# EAGLE schematic System_Schematic (EAGLE 8.7.1)
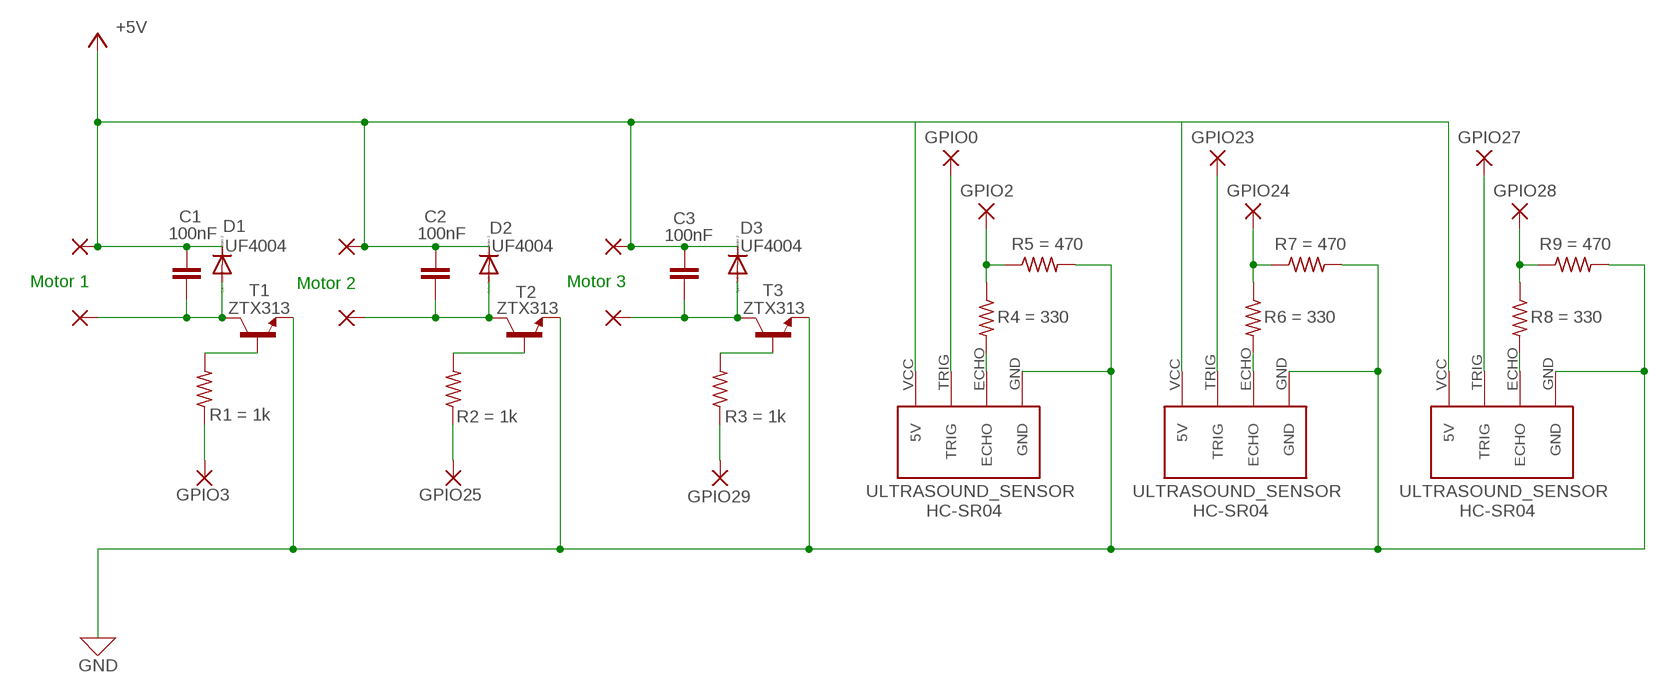
[diagram p0: schematic, sheet 1]

## Parts
C1  C15/6  [C15B6]
C2  C15/6  [C15B6]
C3  C15/6  [C15B6]
D1  BA243A  [DO35-10]
D2  BA243A  [DO35-10]
D3  BA243A  [DO35-10]
J_ULTRASONIC_1  HC-SR04  [HC-SR04_FOOTPRINT]
J_ULTRASONIC_2  HC-SR04  [HC-SR04_FOOTPRINT]
J_ULTRASONIC_3  HC-SR04  [HC-SR04_FOOTPRINT]
PAD1  3,81/1,4  [3,81/1,4]
PAD2  3,81/1,4  [3,81/1,4]
PAD3  3,81/1,4  [3,81/1,4]
PAD4  3,81/1,4  [3,81/1,4]
PAD5  3,81/1,4  [3,81/1,4]
PAD6  3,81/1,4  [3,81/1,4]
PAD7  3,81/1,4  [3,81/1,4]
PAD8  3,81/1,4  [3,81/1,4]
PAD9  3,81/1,4  [3,81/1,4]
PAD10  3,81/1,4  [3,81/1,4]
PAD11  3,81/1,4  [3,81/1,4]
PAD12  3,81/1,4  [3,81/1,4]
PAD13  3,81/1,4  [3,81/1,4]
PAD14  3,81/1,4  [3,81/1,4]
PAD15  3,81/1,4  [3,81/1,4]
R1  R-US_0207/15  [0207/15]
R2  R-US_0207/15  [0207/15]
R3  R-US_0207/15  [0207/15]
R4  R-US_0207/15  [0207/15]
R5  R-US_0207/15  [0207/15]
R6  R-US_0207/15  [0207/15]
R7  R-US_0207/15  [0207/15]
R8  R-US_0207/15  [0207/15]
R9  R-US_0207/15  [0207/15]
T1  2N706  [TO18]
T2  2N706  [TO18]
T3  2N706  [TO18]

## Nets
0: J_ULTRASONIC_1.GND J_ULTRASONIC_2.GND J_ULTRASONIC_3.GND R5.2 R7.2 R9.2 T1.1(E) T2.1(E) T3.1(E) ; supply symbol labelled GND
+5V: C1.1 C2.1 C3.1 D1.C D2.C D3.C J_ULTRASONIC_1.VCC(5V) PAD5.1(P) PAD6.1(P) PAD9.1(P)
+5V1: J_ULTRASONIC_2.VCC(5V)
+5V2: J_ULTRASONIC_3.VCC(5V)
N$1: PAD1.1(P) R1.1
N$2: PAD2.1(P) R2.1
N$3: PAD3.1(P) R3.1
N$4: R1.2 T1.2(B)
N$5: R2.2 T2.2(B)
N$6: R3.2 T3.2(B)
N$7: C1.2 D1.A PAD4.1(P) T1.3(C)
N$8: C2.2 D2.A PAD7.1(P) T2.3(C)
N$9: C3.2 D3.A PAD8.1(P) T3.3(C)
N$10: J_ULTRASONIC_2.TRIG PAD10.1(P)
N$11: J_ULTRASONIC_1.TRIG PAD11.1(P)
N$12: J_ULTRASONIC_2.ECHO R4.2
N$13: J_ULTRASONIC_1.ECHO R8.2
N$14: PAD15.1(P) R8.1 R9.1
N$15: PAD12.1(P) R4.1 R5.1
N$16: J_ULTRASONIC_3.TRIG PAD13.1(P)
N$17: J_ULTRASONIC_3.ECHO R6.2
N$18: PAD14.1(P) R6.1 R7.1

## Notes on the sheet
- Motor 1 | Motor 2 | Motor 3

## Library data of the parts
C1 = capacitor-wima:C: CAPACITOR naming: grid - package width; CAPPYU: 100nF
C2 C3 = capacitor-wima:C: CAPACITOR naming: grid - package width; CAPPY: 100nF
D1-D3 = diode:BA243A: DIODE
J_ULTRASONIC_1-J_ULTRASONIC_3 = Ultrasonic Sensor HC-SR04:HC-SR04: Ultrasonic Sensor HC-SR04
PAD1-PAD15 = wirepad:3,81/1,4: THROUGH-HOLE PAD
R1 = rcl:R-US_: RESISTOR, American symbol; R1: 1k; SPICEPREFIX: 1k
R2 = rcl:R-US_: RESISTOR, American symbol; R2: 1k; SPICEPREFIX: 1k
R3 = rcl:R-US_: RESISTOR, American symbol; R3: 1k; SPICEPREFIX: 1k
R4 = rcl:R-US_: RESISTOR, American symbol; R6: 330; SPICEPREFIX: 1k
R5 = rcl:R-US_: RESISTOR, American symbol; R7: 470; SPICEPREFIX: 1k
R6 = rcl:R-US_: RESISTOR, American symbol; R8: 330; SPICEPREFIX: 1k
R7 = rcl:R-US_: RESISTOR, American symbol; R9: 470; SPICEPREFIX: 1k
R8 = rcl:R-US_: RESISTOR, American symbol; R4: 330; SPICEPREFIX: 1k
R9 = rcl:R-US_: RESISTOR, American symbol; R5: 470; SPICEPREFIX: 1k
T1-T3 = transistor:2N706: NPN TRANSISTOR